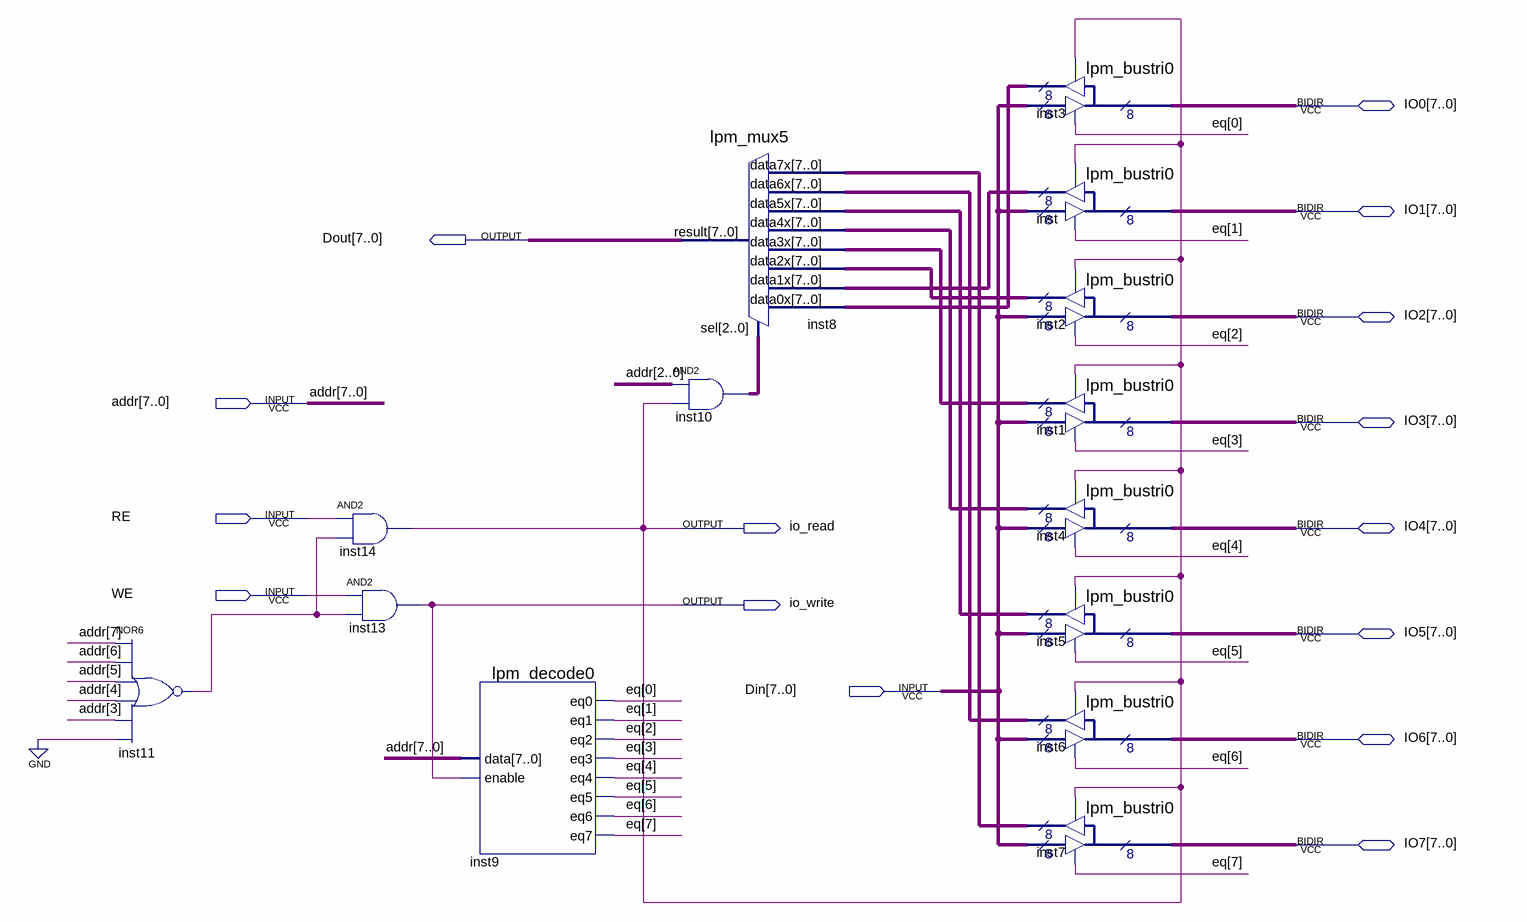
[diagram p0: schematic sheet]
// Quartus schematic IO_PORT.bdf as structural Verilog: 14 symbols, 15 pins
module IO_PORT (
  input  [7:0] addr,
  input  RE,
  input  WE,
  input  [7:0] Din,
  inout  [7:0] IO0,
  inout  [7:0] IO1,
  inout  [7:0] IO2,
  inout  [7:0] IO3,
  inout  [7:0] IO4,
  inout  [7:0] IO5,
  inout  [7:0] IO6,
  inout  [7:0] IO7,
  output [7:0] Dout,
  output io_read,
  output io_write
);

  wire inst11_out;
  wire [2:0] inst10_out;
  wire [7:0] eq, inst1_result, inst2_result, inst3_result, inst4_result, inst5_result, inst6_result,
       inst7_result, inst_result;

  nor inst11 (inst11_out, addr[7], addr[6], addr[5], addr[4], addr[3], 1'b0);
  and inst14 (io_read, RE, inst11_out);
  and inst13 (io_write, WE, inst11_out);
  lpm_decode0 inst9 (
    .data(addr), .enable(io_write), .eq0(eq[0]), .eq1(eq[1]), .eq2(eq[2]), .eq3(eq[3]), .eq4(eq[4]),
    .eq5(eq[5]), .eq6(eq[6]), .eq7(eq[7]));
  lpm_mux5 inst8 (
    .data7x(inst7_result), .data6x(inst6_result), .data5x(inst5_result), .data4x(inst4_result),
    .data3x(inst1_result), .data2x(inst2_result), .data1x(inst_result), .data0x(inst3_result),
    .sel(inst10_out), .result(Dout));
  assign inst10_out = addr[2:0] & {3{io_read}};  // AND2 inst10, 3 bits wide
  lpm_bustri0 inst3 (.enabledt(eq[0]), .data(Din), .enabletr(io_read), .result(inst3_result), .tridata(IO0));
  lpm_bustri0 inst (.enabledt(eq[1]), .data(Din), .enabletr(io_read), .result(inst_result), .tridata(IO1));
  lpm_bustri0 inst2 (.enabledt(eq[2]), .data(Din), .enabletr(io_read), .result(inst2_result), .tridata(IO2));
  lpm_bustri0 inst1 (.enabledt(eq[3]), .data(Din), .enabletr(io_read), .result(inst1_result), .tridata(IO3));
  lpm_bustri0 inst4 (.enabledt(eq[4]), .data(Din), .enabletr(io_read), .result(inst4_result), .tridata(IO4));
  lpm_bustri0 inst5 (.enabledt(eq[5]), .data(Din), .enabletr(io_read), .result(inst5_result), .tridata(IO5));
  lpm_bustri0 inst6 (.enabledt(eq[6]), .data(Din), .enabletr(io_read), .result(inst6_result), .tridata(IO6));
  lpm_bustri0 inst7 (.enabledt(eq[7]), .data(Din), .enabletr(io_read), .result(inst7_result), .tridata(IO7));
endmodule
